# Altium schematic sheet nrf51422_qfaa.SchDoc: nRF51422-QFAA Reference Layout
size A4; Revision: 2.0; SheetNumber: 1; SheetTotal: 1; DrawnBy: RUBR; ProjectNumber: 4393; DocumentSize: A4; PCAName: nRF51422-QFAA Reference Layout
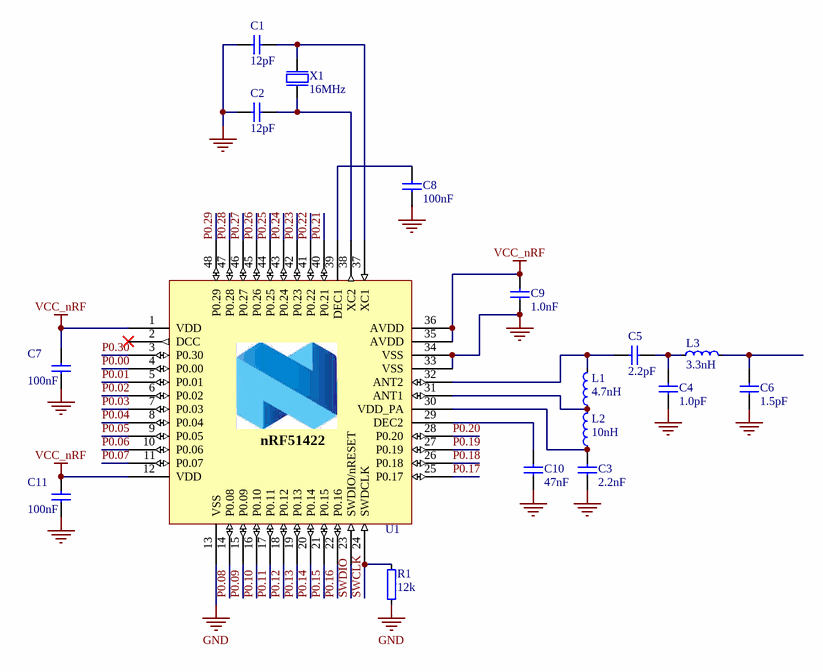
[diagram p0: nrf51422_qfaa.SchDoc]

## Parts
C1  12pF  [CAPC1005X04L]
C2  12pF  [CAPC1005X04L]
C3  2.2nF  [CAPC1005X04L]
C4  1.0pF  [CAPC1005X04L]
C5  2.2pF  [CAPC1005X04L]
C6  1.5pF  [CAPC1005X04L]
C7  100nF  [CAPC1005X04L]
C8  100nF  [CAPC1005X04L]
C9  1.0nF  [CAPC1005X04L]
C10  47nF  [CAPC1005X04L]
C11  100nF  [CAPC1005X04L]
L1  4.7nH  [INDC1005X04L]
L2  10nH  [INDC1005X04L]
L3  3.3nH  [INDC1005X04L]
R1  12k  [RESC1005X04L]
U1  nRF51422-QFAA  [QFN40P600X600X90-48N]  (value not drawn)
X1  16MHz  [BT-XTAL_2520]

## Nets
GND: C1.2 C2.2 C3.2 C4.2 C6.2 C7.2 C8.2 C9.2 C10.2 C11.2 R1.1 U1.13(VSS) U1.33(VSS) U1.34(VSS) U1.49 X1.2(GND) X1.4(GND)
VCC_nRF: C7.1 C9.1 C11.1 U1.1(VDD) U1.12(VDD) U1.35(AVDD) U1.36(AVDD)
P0.00: U1.4(P0.00)
P0.01: U1.5(P0.01)
P0.02: U1.6(P0.02)
P0.03: U1.7(P0.03)
P0.04: U1.8(P0.04)
P0.05: U1.9(P0.05)
P0.06: U1.10(P0.06)
P0.07: U1.11(P0.07)
P0.08: U1.14(P0.08)
P0.09: U1.15(P0.09)
P0.10: U1.16(P0.10)
P0.11: U1.17(P0.11)
P0.12: U1.18(P0.12)
P0.13: U1.19(P0.13)
P0.14: U1.20(P0.14)
P0.15: U1.21(P0.15)
P0.16: U1.22(P0.16)
P0.17: U1.25(P0.17)
P0.18: U1.26(P0.18)
P0.19: U1.27(P0.19)
P0.20: U1.28(P0.20)
P0.21: U1.40(P0.21)
P0.22: U1.41(P0.22)
P0.23: U1.42(P0.23)
P0.24: U1.43(P0.24)
P0.25: U1.44(P0.25)
P0.26: U1.45(P0.26)
P0.27: U1.46(P0.27)
P0.28: U1.47(P0.28)
P0.29: U1.48(P0.29)
P0.30: U1.3(P0.30)
SWCLK: R1.2 U1.24(SWDCLK)
SWDIO: U1.23(SWDIO/nRESET)
NetC1_1: C1.1 U1.37(XC1) X1.1(inp)
NetC2_1: C2.1 U1.38(XC2) X1.3(out)
NetC3_1: C3.1 L2.1 U1.30(VDD_PA)
NetC4_1: C4.1 C5.2 L3.1
NetC5_1: C5.1 L1.2 U1.32(ANT2)
NetC6_1: C6.1 L3.2
NetC8_1: C8.1 U1.39(DEC1)
NetC10_1: C10.1 U1.29(DEC2)
NetL1_1: L1.1 L2.2 U1.31(ANT1)

Not connected (* = marked no-connect by the designer): U1 2(DCC)*

## Notes on the sheet
- Title
- Size
- Date:
- Project Number
- Sheet         of
- Revision
- File:
- Drawn By:
- (in symbol nRF51422-Q48-6x6_DCDC) nRF51422

## Library data of the parts
C1 C2 = C0402-12p: Capacitor, NP0, ±2%; Note: 50V; Artikkelnr Noca: 20029159; Part Number: C0402-12p; Manufacturer: *; Manufacturer Part Number: *; Datasheet: *; Footprint: 0402; LatestRevisionDate: 2011-05-11; Pin Count: 2; Publisher: Nordic Semiconductor; Published: 2009-05-08; Value: 12pF; Supplier: *; Supplier part number: *; 2nd source Supplier: *; 2nd source part number: *
C3 = C0402-2n2: Capacitor, X7R, ±10%; Note: 50V; Artikkelnr Noca: 20039221; Part Number: C0402-2n2; Manufacturer: *; Manufacturer Part Number: *; Datasheet: *; Footprint: 0402; LatestRevisionDate: 2009-11-23; Pin Count: 2; Publisher: Nordic Semiconductor; Published: 2009-05-08; Value: 2.2nF; Supplier: *; Supplier part number: *; 2nd source Supplier: *; 2nd source part number: *
C4 = C0402-1.0p: Capacitor, NP0, ±0.1pF; Note: 50V; Artikkelnr Noca: 20029140; Part Number: C0402-1.0p; Manufacturer: *; Manufacturer Part Number: *; Datasheet: *; Footprint: 0402; LatestRevisionDate: 2009-11-23; Pin Count: 2; Publisher: Nordic Semiconductor; Published: 2009-05-08; Value: 1.0pF; Supplier: *; Supplier part number: *; 2nd source Supplier: *; 2nd source part number: *
C5 = C0402-2.2p: Capacitor, NP0, ±0.1pF; Note: 50V; Artikkelnr Noca: 20029145; Part Number: C0402-2.2p; Manufacturer: *; Manufacturer Part Number: *; Datasheet: *; Footprint: 0402; LatestRevisionDate: 2009-05-08; Pin Count: 2; Publisher: Nordic Semiconductor; Published: 2009-05-08; Value: 2.2pF; Supplier: *; Supplier part number: *; 2nd source Supplier: *; 2nd source part number: *
C6 = C0402-1.5p: Capacitor, NP0, ±0.1pF; Note: 50V; Artikkelnr Noca: 20029139; Part Number: C0402-1.5p; Manufacturer: *; Manufacturer Part Number: *; Datasheet: *; Footprint: 0402; LatestRevisionDate: 2009-11-23; Pin Count: 2; Publisher: Nordic Semiconductor; Published: 2009-05-08; Value: 1.5pF; Supplier: *; Supplier part number: *; 2nd source Supplier: *; 2nd source part number: *
C7 C8 C11 = C0402-100n: Capacitor, X7R, ±10%; Note: 16V; Artikkelnr Noca: 20039200; Part Number: C0402-100n; Manufacturer: *; Manufacturer Part Number: *; Datasheet: *; Footprint: 0402; LatestRevisionDate: 2009-11-23; Pin Count: 2; Publisher: Nordic Semiconductor; Published: 2009-05-08; Value: 100nF; Supplier: *; Supplier part number: *; 2nd source Supplier: *; 2nd source part number: *
C9 = C0402-1n0: Capacitor, X7R, ±10%; Note: 50V; Artikkelnr Noca: 20039223; Part Number: C0402-1n0; Manufacturer: *; Manufacturer Part Number: *; Datasheet: *; Footprint: 0402; LatestRevisionDate: 2009-11-23; Pin Count: 2; Publisher: Nordic Semiconductor; Published: 2009-05-08; Value: 1.0nF; Supplier: *; Supplier part number: *; 2nd source Supplier: *; 2nd source part number: *
C10 = C0402-47n: Capacitor, X7R, ±10%; Note: Chip Cap 10%; Artikkelnr Noca: N.A.; Part Number: C0402-47n; Manufacturer: *; Manufacturer Part Number: *; Datasheet: *; Footprint: 0402; LatestRevisionDate: 2009-05-08; Pin Count: 2; Publisher: Nordic Semiconductor; Published: 2009-05-08; Value: 47nF; Supplier: *; Supplier part number: *; 2nd source Supplier: *; 2nd source part number: *
L1 = L0402-4n7: Inductor, 160mA, ±0.1nH; Manufacturer: Murata; Manufacturer Part Number: LQP15MN4N7B02D; Note: High frequency chip inductor ±5%; Artikkelnr Noca: 33029164; Part Number: L0402-4n7; Datasheet: http://search.murata.co.jp/Ceramy/image/img/PDF/ENG/L0075S0084LQP15M.pdf; Footprint: 0402; LatestRevisionDate: 2012-09-19; Pin Count: 2; Publisher: Nordic Semiconductor; Published: 2009-05-08; Value: 4.7nH; Supplier: Digi-Key; Supplier part number: 490-1132-1-ND; 2nd source Supplier: *; 2nd source part number: *
L2 = L0402-10n: Inductor, 100mA, ±2%; Manufacturer: Murata; Manufacturer Part Number: LQP15MN10NG02D; Note: High frequency chip inductor ±5%; Artikkelnr Noca: N.A.; Part Number: L0402-10n; Datasheet: http://search.murata.co.jp/Ceramy/image/img/PDF/ENG/L0075S0084LQP15M.pdf; Footprint: 0402; LatestRevisionDate: 2012-09-19; Pin Count: 2; Publisher: Nordic Semiconductor; Published: 2010-07-12; Value: 10nH; Supplier: Mouser; Supplier part number: 81-LQP15MN10NG02D; 2nd source Supplier: *; 2nd source part number: *
L3 = L0402-3n3: Inductor, 190mA, ±0.1nH; Manufacturer: Murata; Manufacturer Part Number: LQP15MN3N3B02D; Note: High frequency chip inductor ±5%; Artikkelnr Noca: N.A.; Part Number: L0402-3n3; Datasheet: http://search.murata.co.jp/Ceramy/image/img/PDF/ENG/L0075S0084LQP15M.pdf; Footprint: 0402; LatestRevisionDate: 2012-09-19; Pin Count: 2; Publisher: Nordic Semiconductor; Published: 2009-05-08; Value: 3.3nH; Supplier: Digi-Key; Supplier part number: 490-1130-1-ND; 2nd source Supplier: *; 2nd source part number: *
R1 = R0402-12k: Resistor, ±1%, 0.063W; Note: Chip Res 1%; Artikkelnr Noca: 27049099; Part Number: R0402-12k; Manufacturer: *; Manufacturer Part Number: *; Datasheet: *; Footprint: 0402; LatestRevisionDate: 2009-11-23; Pin Count: 2; Publisher: Nordic Semiconductor; Published: 2009-05-08; Value: 12k; Supplier: Farnell; Supplier part number: 173-8865; 2nd source Supplier: *; 2nd source part number: *
U1 = nRF51422-Q48-6x6_DCDC: Multi-protocol ANT System-on-Chip; Manufacturer: Nordic Semiconductor; Note: nRF51422 - QFN48 6x6 0.4mm pitch; Artikkelnr Noca: 15079202; Part Number: nRF51422-Q48-6x6_DCDC; Manufacturer Part Number: nRF51422-QFAA; Datasheet: *; Footprint: QFN-48; LatestRevisionDate: 2012-07-10; Pin Count: 48; Publisher: Nordic Semiconductor; Published: 2012-07-08; Value: nRF51422-QFAA; Supplier: Nordic Semiconductor; Supplier part number: *; 2nd source Supplier: *; 2nd source part number: *
X1 = NX2520SA-16MHZ-STD-CSW-5: XTAL SMD 2520, 16MHz, 8pF, ±40ppm; Manufacturer: NDK; Note: XTAL SMD 16.000MHz; Artikkelnr Noca: 22019192; Part Number: NX2520SA-16MHZ-STD-CSW-5; Manufacturer Part Number: NX2520SA-16MHZ-STD-CSW-5; Datasheet: http://www.ndk.com/images/products/catalog/c_NX2520SA-STD-CSW-5_e.pdf; LatestRevisionDate: 2012-06-15; Pin Count: 4; Publisher: Nordic Semiconductor; Published: 2012-06-15; Value: 16MHz; Supplier: Digi-Key; Supplier part number: 644-1169-1-ND; 2nd source Supplier: *; 2nd source part number: *